# Altium schematic sheet FDC2214.SchDoc
size A4; SheetNumber: 4; SheetTotal: 5
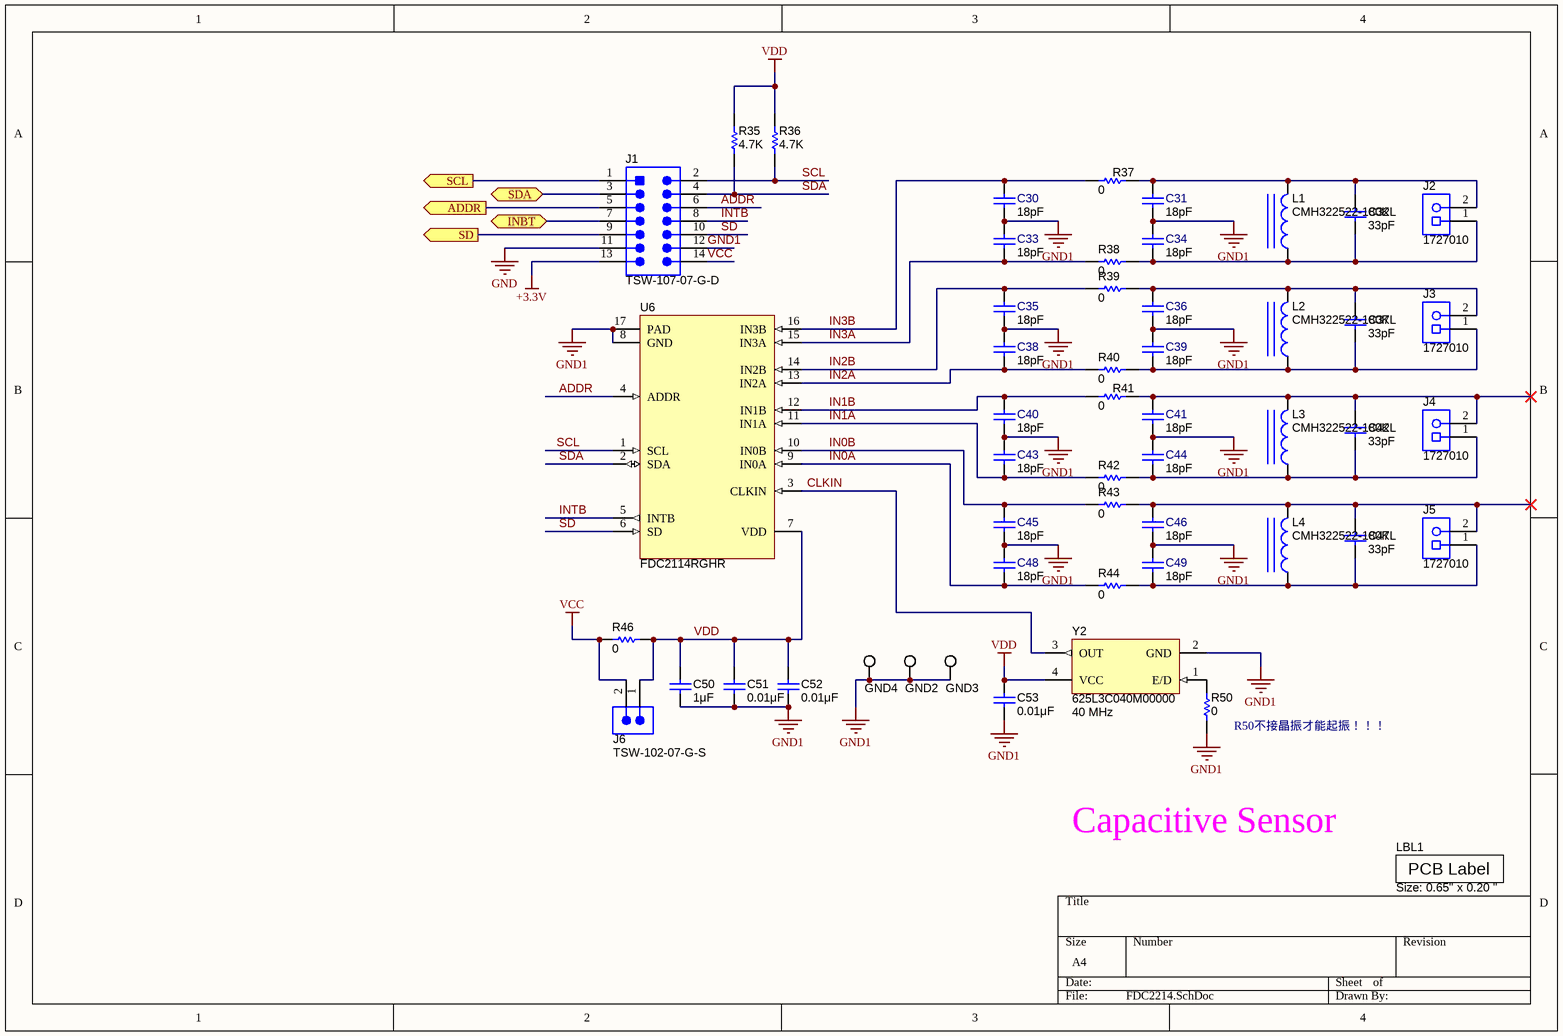
[diagram p0: FDC2214.SchDoc]

## Parts
C30  ValueDisplayed: 18pF  [0603]  (hidden comment: GRM1885C2A180JA01D)
C31  ValueDisplayed: 18pF  [0603]  (hidden comment: GRM1885C2A180JA01D)
C32  ValueDisplayed: 33pF  [0603_950]  (hidden comment: CL10C330FB8NNNC)
C33  ValueDisplayed: 18pF  [0603]  (hidden comment: GRM1885C2A180JA01D)
C34  ValueDisplayed: 18pF  [0603]  (hidden comment: GRM1885C2A180JA01D)
C35  ValueDisplayed: 18pF  [0603]  (hidden comment: GRM1885C2A180JA01D)
C36  ValueDisplayed: 18pF  [0603]  (hidden comment: GRM1885C2A180JA01D)
C37  ValueDisplayed: 33pF  [0603_950]  (hidden comment: CL10C330FB8NNNC)
C38  ValueDisplayed: 18pF  [0603]  (hidden comment: GRM1885C2A180JA01D)
C39  ValueDisplayed: 18pF  [0603]  (hidden comment: GRM1885C2A180JA01D)
C40  ValueDisplayed: 18pF  [0603]  (hidden comment: GRM1885C2A180JA01D)
C41  ValueDisplayed: 18pF  [0603]  (hidden comment: GRM1885C2A180JA01D)
C42  ValueDisplayed: 33pF  [0603_950]  (hidden comment: CL10C330FB8NNNC)
C43  ValueDisplayed: 18pF  [0603]  (hidden comment: GRM1885C2A180JA01D)
C44  ValueDisplayed: 18pF  [0603]  (hidden comment: GRM1885C2A180JA01D)
C45  ValueDisplayed: 18pF  [0603]  (hidden comment: GRM1885C2A180JA01D)
C46  ValueDisplayed: 18pF  [0603]  (hidden comment: GRM1885C2A180JA01D)
C47  ValueDisplayed: 33pF  [0603_950]  (hidden comment: CL10C330FB8NNNC)
C48  ValueDisplayed: 18pF  [0603]  (hidden comment: GRM1885C2A180JA01D)
C49  ValueDisplayed: 18pF  [0603]  (hidden comment: GRM1885C2A180JA01D)
C50  ValueDisplayed: 1μF  [0402]  (hidden comment: GRM155R61A105KE15D)
C51  ValueDisplayed: 0.01μF  [0402]  (hidden comment: C1005X7R1C103K)
C52  ValueDisplayed: 0.01μF  [0402]  (hidden comment: C1005X7R1C103K)
C53  ValueDisplayed: 0.01μF  [0402]  (hidden comment: C1608C0G1E103J)
GND2  5015  [Testpoint_Keystone_Miniature]  (value not drawn)
GND3  5015  [Testpoint_Keystone_Miniature]  (value not drawn)
GND4  5015  [Testpoint_Keystone_Miniature]  (value not drawn)
J1  TSW-107-07-G-D  [TSW-107-07-G-D]
J2  1727010  [PhoenixConact_1727010]
J3  1727010  [PhoenixConact_1727010]
J4  1727010  [PhoenixConact_1727010]
J5  1727010  [PhoenixConact_1727010]
J6  TSW-102-07-G-S  [TSW-102-07-G-S]
L1  CMH322522-180KL  [CMH322522]
L2  CMH322522-180KL  [CMH322522]
L3  CMH322522-180KL  [CMH322522]
L4  CMH322522-180KL  [CMH322522]
LBL1  Size: 0.65" x 0.20 "  [Label_650x200]
R35  value 4.7K  [0402_R]  (hidden comment: CRCW06030000Z0EA)
R36  value 4.7K  [0402_R]  (hidden comment: CRCW06030000Z0EA)
R37  value 0  [0805_HV]  (hidden comment: CRCW08050000Z0EA)
R38  value 0  [0805_HV]  (hidden comment: CRCW08050000Z0EA)
R39  value 0  [0805_HV]  (hidden comment: CRCW08050000Z0EA)
R40  value 0  [0805_HV]  (hidden comment: CRCW08050000Z0EA)
R41  value 0  [0805_HV]  (hidden comment: CRCW08050000Z0EA)
R42  value 0  [0805_HV]  (hidden comment: CRCW08050000Z0EA)
R43  value 0  [0805_HV]  (hidden comment: CRCW08050000Z0EA)
R44  value 0  [0805_HV]  (hidden comment: CRCW08050000Z0EA)
R46  value 0  [0805_R]  (hidden comment: CRCW06030000Z0EA)
R50  value 0  [0805_HV]  (hidden comment: CRCW06030000Z0EA)
U6  FDC2114RGHR  [RGH0016A]
Y2  625L3C040M00000  Frequency: 40 MHz  [OSC_CTS_625]

## Ports
ADDR (out, see Insight[3B], STM32f103c8t6[2D]), INBT (bidir, see Insight[3C], STM32f103c8t6[2D]), SCL (out, see Insight[3A], STM32f103c8t6[2D]), SD (out, see Insight[3B], STM32f103c8t6[2D]), SDA (bidir, see Insight[3B], STM32f103c8t6[2D])

## Nets
+3.3V: J1.13
GND: J1.11
GND1: C30.1 C31.1 C33.2 C34.2 C35.1 C36.1 C38.2 C39.2 C40.1 C41.1 C43.2 C44.2 C45.1 C46.1 C48.2 C49.2 C50.2 C51.2 C52.2 C53.2 GND2.1 GND3.1 GND4.1 J1.12 R50.1 U6.8(GND) U6.17(PAD) Y2.2(GND)
VCC: J1.14 J6.2 R46.1
VDD: C50.1 C51.1 C52.1 C53.1 J6.1 R35.2 R36.2 R46.2 U6.7(VDD) Y2.4(VCC)
ADDR: J1.5 ; port ADDR
ADDR: J1.6 U6.4(ADDR)  [a separate net that carries the same name]
CLKIN: U6.3(CLKIN) Y2.3(OUT)
IN0A: C48.1 R44.1 U6.9(IN0A)
IN0B: C45.2 R43.1 U6.10(IN0B)
IN1A: C43.1 R42.1 U6.11(IN1A)
IN1B: C40.2 R41.1 U6.12(IN1B)
IN2A: C38.1 R40.1 U6.13(IN2A)
IN2B: C35.2 R39.1 U6.14(IN2B)
IN3A: C33.1 R38.1 U6.15(IN3A)
IN3B: C30.2 R37.1 U6.16(IN3B)
INBT: J1.7 ; port INBT
INTB: J1.8 U6.5(INTB)
SCL: J1.1 ; port SCL
SCL: J1.2 R36.1 U6.1(SCL)  [a separate net that carries the same name]
SD: J1.9 ; port SD
SD: J1.10 U6.6(SD)  [a separate net that carries the same name]
SDA: J1.3 ; port SDA
SDA: J1.4 R35.1 U6.2(SDA)  [a separate net that carries the same name]
NetC31_2: C31.2 C32.1 J2.2 L1.2 R37.2
NetC32_2: C32.2 C34.1 J2.1 L1.1 R38.2
NetC36_2: C36.2 C37.1 J3.2 L2.2 R39.2
NetC37_2: C37.2 C39.1 J3.1 L2.1 R40.2
NetC41_2: C41.2 C42.1 J4.2 L3.2 R41.2
NetC42_2: C42.2 C44.1 J4.1 L3.1 R42.2
NetC46_2: C46.2 C47.1 J5.2 L4.2 R43.2
NetC47_2: C47.2 C49.1 J5.1 L4.1 R44.2
NetR50_2: R50.2 Y2.1(E/D)

## Notes on the sheet
- (near R50) R50不接晶振才能起振！！！
- Capacitive Sensor
- (in symbol THT-14-423-10) PCB Label

## Library data of the parts
C30 C31 C33-C36 C38-C41 C43-C46 C48 C49 = GRM1885C2A180JA01D: CAP, CERM, 18pF, 100V, +/-5%, C0G/NP0, 0603; Manufacturer: MuRata; Polarized: N; CompType: Capacitor; U/M: EA; Cap_F: 0.000000000018; Tolerance_%: 5; Value1: Unknown; VDC_V: 100; TaMin_C: -55; TaMax_C: 125; SymbolVersion: 2008-07-09; Value: 18pF; PartNumber: GRM1885C2A180JA01D; PackageReference: 0603; RoHS: Y; Value2: 100V; MountType: SMT; Technology: Ceramic; TempCo: C0G/NP0; Cap_Case: 0603; Published: 2008-06-19; Publisher: Texas Instruments; LatestRevisionDate: 2014-04-03; ComponentLink1Description: Datasheet link; ComponentLink1URL: http://search.murata.co.jp/Ceramy/PnsearchViewAction.do?HnOFG=ON&HnNFG=ON&SEL_CNT=50&sLang=en&sKey=GRM1885C2A180JA01D&x=9&y=9&search=startwith; Supplier 1: Digi-Key; Supplier Part Number 1: 490-1333-1-ND; Supplier 2: Mouser; Supplier Part Number 2: 81-GRM1885C2A180JA01
C32 C37 C42 C47 = CL10C330FB8NNNC: CAP, CERM, 33 pF, 50 V, +/- 1%, C0G/NP0, 0603_950; Manufacturer: Samsung; Polarized: N; CompType: Capacitor; Value: 33pF; U/M: EA; Cap_F: 0.000000000033; Tolerance_%: 1; Value1: Unknown; VDC_V: 50; Value2: 50V; TaMin_C: -55; TaMax_C: 125; Cap_Case: 0603; SymbolVersion: 2008-07-09; PartNumber: CL10C330FB8NNNC; PackageReference: 0603_950; RoHS: Y; MountType: SMT; Technology: Ceramic; TempCo: C0G/NP0; Published: 2008-06-19; Publisher: Texas Instruments; LatestRevisionDate: 2015-03-17; ComponentLink1Description: Datasheet link; ComponentLink1URL: http://www.samsungsem.com/kr/front/downloadcms.do?path=/kr/support/product-search/mlcc/__icsFiles/afieldfile/2014/11/05&fileName=S_CL10C330FB8NNNC.pdf; Supplier 1: Digi-Key; Supplier Part Number 1: 1276-2262-1-ND
C50 = GRM155R61A105KE15D: CAP, CERM, 1uF, 10V, +/-10%, X5R, 0402; Manufacturer: MuRata; Polarized: N; CompType: Capacitor; U/M: EA; Cap_F: 0.000001; Tolerance_%: 10; Value1: Unknown; TaMin_C: -55; TaMax_C: 85; SymbolVersion: 2008-07-09; Value: 1uF; PartNumber: GRM155R61A105KE15D; PackageReference: 0402; RoHS: Y; VDC_V: 10; Value2: 10V; MountType: SMT; Technology: Ceramic; TempCo: X5R; Cap_Case: 0402; Published: 2008-06-19; Publisher: Texas Instruments; LatestRevisionDate: 2013-02-06; LatestRevisionNote: Changed publisher; ComponentLink1Description: Datasheet link; ComponentLink1URL: http://search.murata.co.jp/Ceramy/PnsearchViewAction.do?HnOFG=ON&HnNFG=ON&SEL_CNT=50&sLang=en&sKey=GRM155R61A105KE15D&x=9&y=9&search=startwith; Supplier 1: Digi-Key; Supplier Part Number 1: 490-3890-1-ND; Supplier 2: Mouser; Supplier Part Number 2: 81-GRM155R61A105KE15; Supplier 3: Farnell; Supplier Part Number 3: 1735523
C51 = C1005X7R1C103K: CAP CER 0.1UF 16V 5% X7R 0402; Manufacturer: TDK; Polarized: N; CompType: Capacitor; Value: 0.01uF; U/M: EA; Cap_F: 0.00000001; Tolerance_%: 10; ESR_ohm: 0.0623; Value1: 0.0623 ohm; VDC_V: 16; TaMin_C: -55; TaMax_C: 125; SymbolVersion: 2008-07-09; PartNumber: C1005X7R1C103K; PackageReference: 0402; RoHS: Y; Value2: 16V; MountType: SMT; Technology: Ceramic; TempCo: X7R; Cap_Case: 0402; Published: 2008-06-19; Publisher: Texas Instruments; LatestRevisionDate: 2015-02-18; ComponentLink1Description: Datasheet link; ComponentLink1URL: http://www.tdk.co.jp/tefe02/e412_c.pdf; Supplier 1: Digi-Key; Supplier Part Number 1: 445-1262-1-ND; Supplier 2: Farnell; Supplier Part Number 2: 1844125
C52 = C1005X7R1C103K: CAP, CERM, 0.01 μF, 16 V, +/- 10%, X7R, 0402; Manufacturer: TDK; Polarized: N; CompType: Capacitor; Value: 0.01uF; U/M: EA; Cap_F: 0.00000001; Tolerance_%: 10; ESR_ohm: 0.0623; Value1: 0.0623 ohm; VDC_V: 16; Value2: 16V; TaMin_C: -55; TaMax_C: 125; SymbolVersion: 2008-07-09; PartNumber: C1005X7R1C103K; PackageReference: 0402; RoHS: Y; MountType: SMT; Technology: Ceramic; TempCo: X7R; Cap_Case: 0402; Published: 2008-06-19; Publisher: Texas Instruments; LatestRevisionDate: 2015-02-18; ComponentLink1Description: Datasheet link; ComponentLink1URL: http://www.tdk.co.jp/tefe02/e412_c.pdf; Supplier 1: Digi-Key; Supplier Part Number 1: 445-1262-1-ND; Supplier 2: Farnell; Supplier Part Number 2: 1844125
C53 = C1608C0G1E103J: CAP, CERM, 0.01uF, 25V, +/-5%, C0G/NP0, 0603; Manufacturer: TDK; Polarized: N; CompType: Capacitor; U/M: EA; Cap_F: 0.00000001; Tolerance_%: 5; VDC_V: 25; TaMin_C: -55; TaMax_C: 125; Cap_Case: 0603; SymbolVersion: 2008-07-09; Value: 0.01uF; PartNumber: C1608C0G1E103J; PackageReference: 0603; RoHS: Y; Value1: ?; Value2: 25V; MountType: SMT; Technology: Ceramic; TempCo: C0G/NP0; Published: 2008-06-19; Publisher: Texas Instruments; LatestRevisionDate: 2012-08-23; LatestRevisionNote: Changed publisher; ComponentLink1Description: Datasheet link; ComponentLink1URL: http://www.tdk.co.jp/tefe02/e412_c.pdf; Alternate PartNumber: -; Alternate Manufacturer: -; Supplier 1: Digi-Key; Supplier Part Number 1: 445-2664-1-ND; Supplier 2: Arrow; Supplier Part Number 2: C1608C0G1E103J
GND2-GND4 = 5015: Test Point, Miniature, SMT; Manufacturer: Keystone; CompType: Test Point Loop; U/M: EA; SymbolVersion: 2008-07-10; PartNumber: 5015; Value: SMT; PackageReference: Testpoint_Keystone_Miniature; RoHS: Y; MountType: SMT; ComponentLink1Description: Datasheet Link; ComponentLink1URL: http://www.keyelco.com/userAssets/store/files/5015.PDF; Publisher: Texas Instruments; LatestRevisionDate: 2014-09-23; Supplier 1: Digi-Key; Supplier Part Number 1: 5015KCT-ND
J1 = TSW-107-07-G-D: Header, 100mil, 7x2, Gold, TH; Manufacturer: Samtec; SymbolCreator: a0412235; U/M: EA; SymbolVersion: 2013-12-22; PartNumber: TSW-107-07-G-D; PackageReference: 7x2 Header; ClassName: Header; CompType: Header; RoHS: Y; MountType: TH; ComponentLink1Description: Datasheet Link; ComponentLink1URL: http://samtec.com/ftppub/pdf/TSW_TH.PDF; Publisher: Texas Instruments; LatestRevisionDate: 2015-02-04; Supplier 1: Digi-Key; Supplier Part Number 1: SAM1028-07-ND
J2-J5 = 1727010: Conn Term Block, 2POS, 3.81mm, TH; Manufacturer: Phoenix Contact; SymbolCreator: a0412235; CompType: Terminal Block; U/M: EA; Value: 2x1; SymbolVersion: 2013-09-04; PartNumber: 1727010; PackageReference: 2POS Terminal Block; RoHS: Y; MountType: TH; ComponentLink1Description: Datasheet Link; ComponentLink1URL: http://eshop.phoenixcontact.com/phoenix/pdf.do?UID=1727010&general=usen; Publisher: Texas Instruments; LatestRevisionDate: 2015-02-16; Supplier 1: Digi-Key; Supplier Part Number 1: 277-1947-ND
J6 = TSW-102-07-G-S: Header, TH, 100mil, 2x1, Gold plated, 230 mil above insulator; Manufacturer: Samtec, Inc.; SymbolCreator: a0412235; U/M: EA; SymbolVersion: 2013-03-14; PartNumber: TSW-102-07-G-S; ClassName: Header; CompType: Header; RoHS: Y; PackageReference: TSW-102-07-G-S; MountType: TH; ComponentLink1Description: Datasheet Link; ComponentLink1URL: http://samtec.com/ftppub/pdf/TSW_TH.PDF; Publisher: Texas Instruments; LatestRevisionDate: 2013-04-23; Supplier 1: Digi-Key; Supplier Part Number 1: SAM1029-02-ND
L1-L4 = CMH322522-180KL: Inductor, Shielded, Ferrite, 18 μH, 0.12 A, 3.3 ohm, SMD; Manufacturer: Bourns; Value: 18uH; Ind_H: 18.0E-6; ValueDisplayed: 18μH; Imax_A: 0.12; Irms: 0.12A @ 20C rise; DCR_ohm: 3.3; Value1: 3.3 ohm; Value2: 0.12A; SymbolVersion: 2008-07-23; CompType: Inductor; PartNumber: CMH322522-180KL; Technology: Shielded; MountType: SMT; Material: Ferrite; PackageReference: 3.2x2.2x2.5mm; Published: 2008-06-26; Publisher: Texas Instruments; LatestRevisionDate: 2015-04-21; ComponentLink1Description: Datasheet link; ComponentLink1URL: http://www.bourns.com/data/global/pdfs/CMH322522.pdf; RoHS: Y; Supplier 1: Digi-Key; Supplier Part Number 1: CMH322522-180KLCT-ND; Supplier 2: Mouser; Supplier Part Number 2: 652-CMH322522-180KL
LBL1 = THT-14-423-10: Thermal Transfer Printable Labels, 0.650" W x 0.200" H - 10,000 per roll; Manufacturer: Brady; SymbolCreator: a0412235; CompType: Label; SymbolVersion: 2012-06-12; ClassName: Label; PartNumber: THT-14-423-10; RoHS: Y; PackageReference: PCB Label 0.650"H x 0.200"W; MountType: N/A; ComponentLink1Description: Web Page; ComponentLink1URL: http://www.bradyid.com/bradyid/pdpv/THT-14-423-10.html; Note: Size: 0.65" x 0.20 "; Publisher: Texas Instruments; LatestRevisionDate: 2012-07-31; LatestRevisionNote: Initial Version; Alternate Manufacturer: -; Alternate PartNumber: -; Supplier 1: Farnell; Supplier Part Number 1: 2065596; Supplier 2: Newark; Supplier Part Number 2: 97C5133
R35 R36 = CRCW06030000Z0EA: 4.7K; Manufacturer: Vishay-Dale; CompType: Resistor; Res_ohm: 0; Value_Code: 0000; Tolerance_%: 5; Value1: 5%; Power_W: 0.1; Value2: 0.1W; VDC_V: 75; TempCo: 200 ppm/C; EIA_Code: E24; U/M: EA; SymbolVersion: 2009-05-29; PartNumber: CRCW06030000Z0EA; PackageReference: 0603; RoHS: Y; MountType: SMT; Technology: Thick Film; Published: 2008-06-26; Publisher: Texas Instruments; LatestRevisionDate: 2013-01-08; ComponentLink1Description: Datasheet link; ComponentLink1URL: http://www.vishay.com/docs/20035/dcrcwe3.pdf; Supplier 1: Digi-Key; Supplier Part Number 1: 541-0.0GCT-ND; Supplier 2: Mouser; Supplier Part Number 2: 71-CRCW0603-0-E3; Supplier 3: Farnell; Supplier Part Number 3: 1469739
R37-R44 = CRCW08050000Z0EA: RES, 0 ohm, 5%, 0.125W, 0805; Manufacturer: Vishay-Dale; CompType: Resistor; Value_Code: 0000; Tolerance_%: 5; Power_W: 0.125; VDC_V: 150; TempCo: 200 ppm/C; EIA_Code: E24; U/M: EA; SymbolVersion: 2009-05-29; PartNumber: CRCW08050000Z0EA; PackageReference: 0805; RoHS: Y; Res_ohm: 0; Value1: 5%; Value2: 0.125W; MountType: SMT; Technology: Thick Film; Published: 2008-06-26; Publisher: Texas Instruments; LatestRevisionDate: 2014-04-18; ComponentLink1Description: Datasheet link; ComponentLink1URL: http://www.vishay.com/docs/20035/dcrcwe3.pdf; Supplier 1: Digi-Key; Supplier Part Number 1: 541-0.0ACT-ND; Supplier 2: Mouser; Supplier Part Number 2: 71-CRCW0805-0-E3; Supplier 3: Farnell; Supplier Part Number 3: 1469846
R46 R50 = CRCW06030000Z0EA: RES, 0 ohm, 5%, 0.1W, 0603; Manufacturer: Vishay-Dale; CompType: Resistor; Value_Code: 0000; Tolerance_%: 5; Power_W: 0.1; VDC_V: 75; TempCo: 200 ppm/C; EIA_Code: E24; U/M: EA; SymbolVersion: 2009-05-29; PartNumber: CRCW06030000Z0EA; PackageReference: 0603; RoHS: Y; Res_ohm: 0; Value1: 5%; Value2: 0.1W; MountType: SMT; Technology: Thick Film; Published: 2008-06-26; Publisher: Texas Instruments; LatestRevisionDate: 2013-01-08; ComponentLink1Description: Datasheet link; ComponentLink1URL: http://www.vishay.com/docs/20035/dcrcwe3.pdf; Supplier 1: Digi-Key; Supplier Part Number 1: 541-0.0GCT-ND; Supplier 2: Mouser; Supplier Part Number 2: 71-CRCW0603-0-E3; Supplier 3: Farnell; Supplier Part Number 3: 1469739
U6 = FDC2114RGHR: Multi-Channel 12/26-Bit Capacitance to Digital Converter (FDC) for Capacitive Sensing, RGH0016A; Manufacturer: Texas Instruments; SymbolCreator: a0411947; CompType: IC; U/M: EA; SymbolVersion: 2014-04-21; PartNumber: FDC2114RGHR; PackageReference: RGH0016A; MountType: SMT; ComponentLink1Description: Datasheet Link; ComponentLink1URL: https://sps06.itg.ti.com/sites/KMS/crossdivteams/altium/docs/ComponentDatasheets/2015-03-12 - FDC2112_FDC2114_SNOSCZ5.pdf; RoHS: Y; Publisher: Texas Instruments; LatestRevisionDate: 2015-03-20; Alternate Manufacturer: Texas Instruments
Y2 = 625L3C040M00000: OSC, 40 MHz, 3.3 V, SMD; Manufacturer: CTS Electrocomponents; SymbolCreator: a0411947; CompType: Oscillator; U/M: EA; TaMin_C: -20; TaMax_C: 70; Frequency Stability: ±50ppm; SymbolVersion: 2013-04-01; PartNumber: 625L3C040M00000; PackageReference: 2.5x1x2.5mm; MountType: SMT; RoHS: Y; ComponentLink1Description: Datasheet Link; ComponentLink1URL: http://www.ctscorp.com/components/Datasheets/008-0329-0.pdf; Publisher: Texas Instruments; LatestRevisionDate: 2015-02-04; Supplier 1: Digi-Key; Supplier Part Number 1: CTX815CT-ND; Supplier 2: Mouser; Supplier Part Number 2: 774-625L3C040M00000